# Altium schematic sheet Schematic.SchDoc
size A2
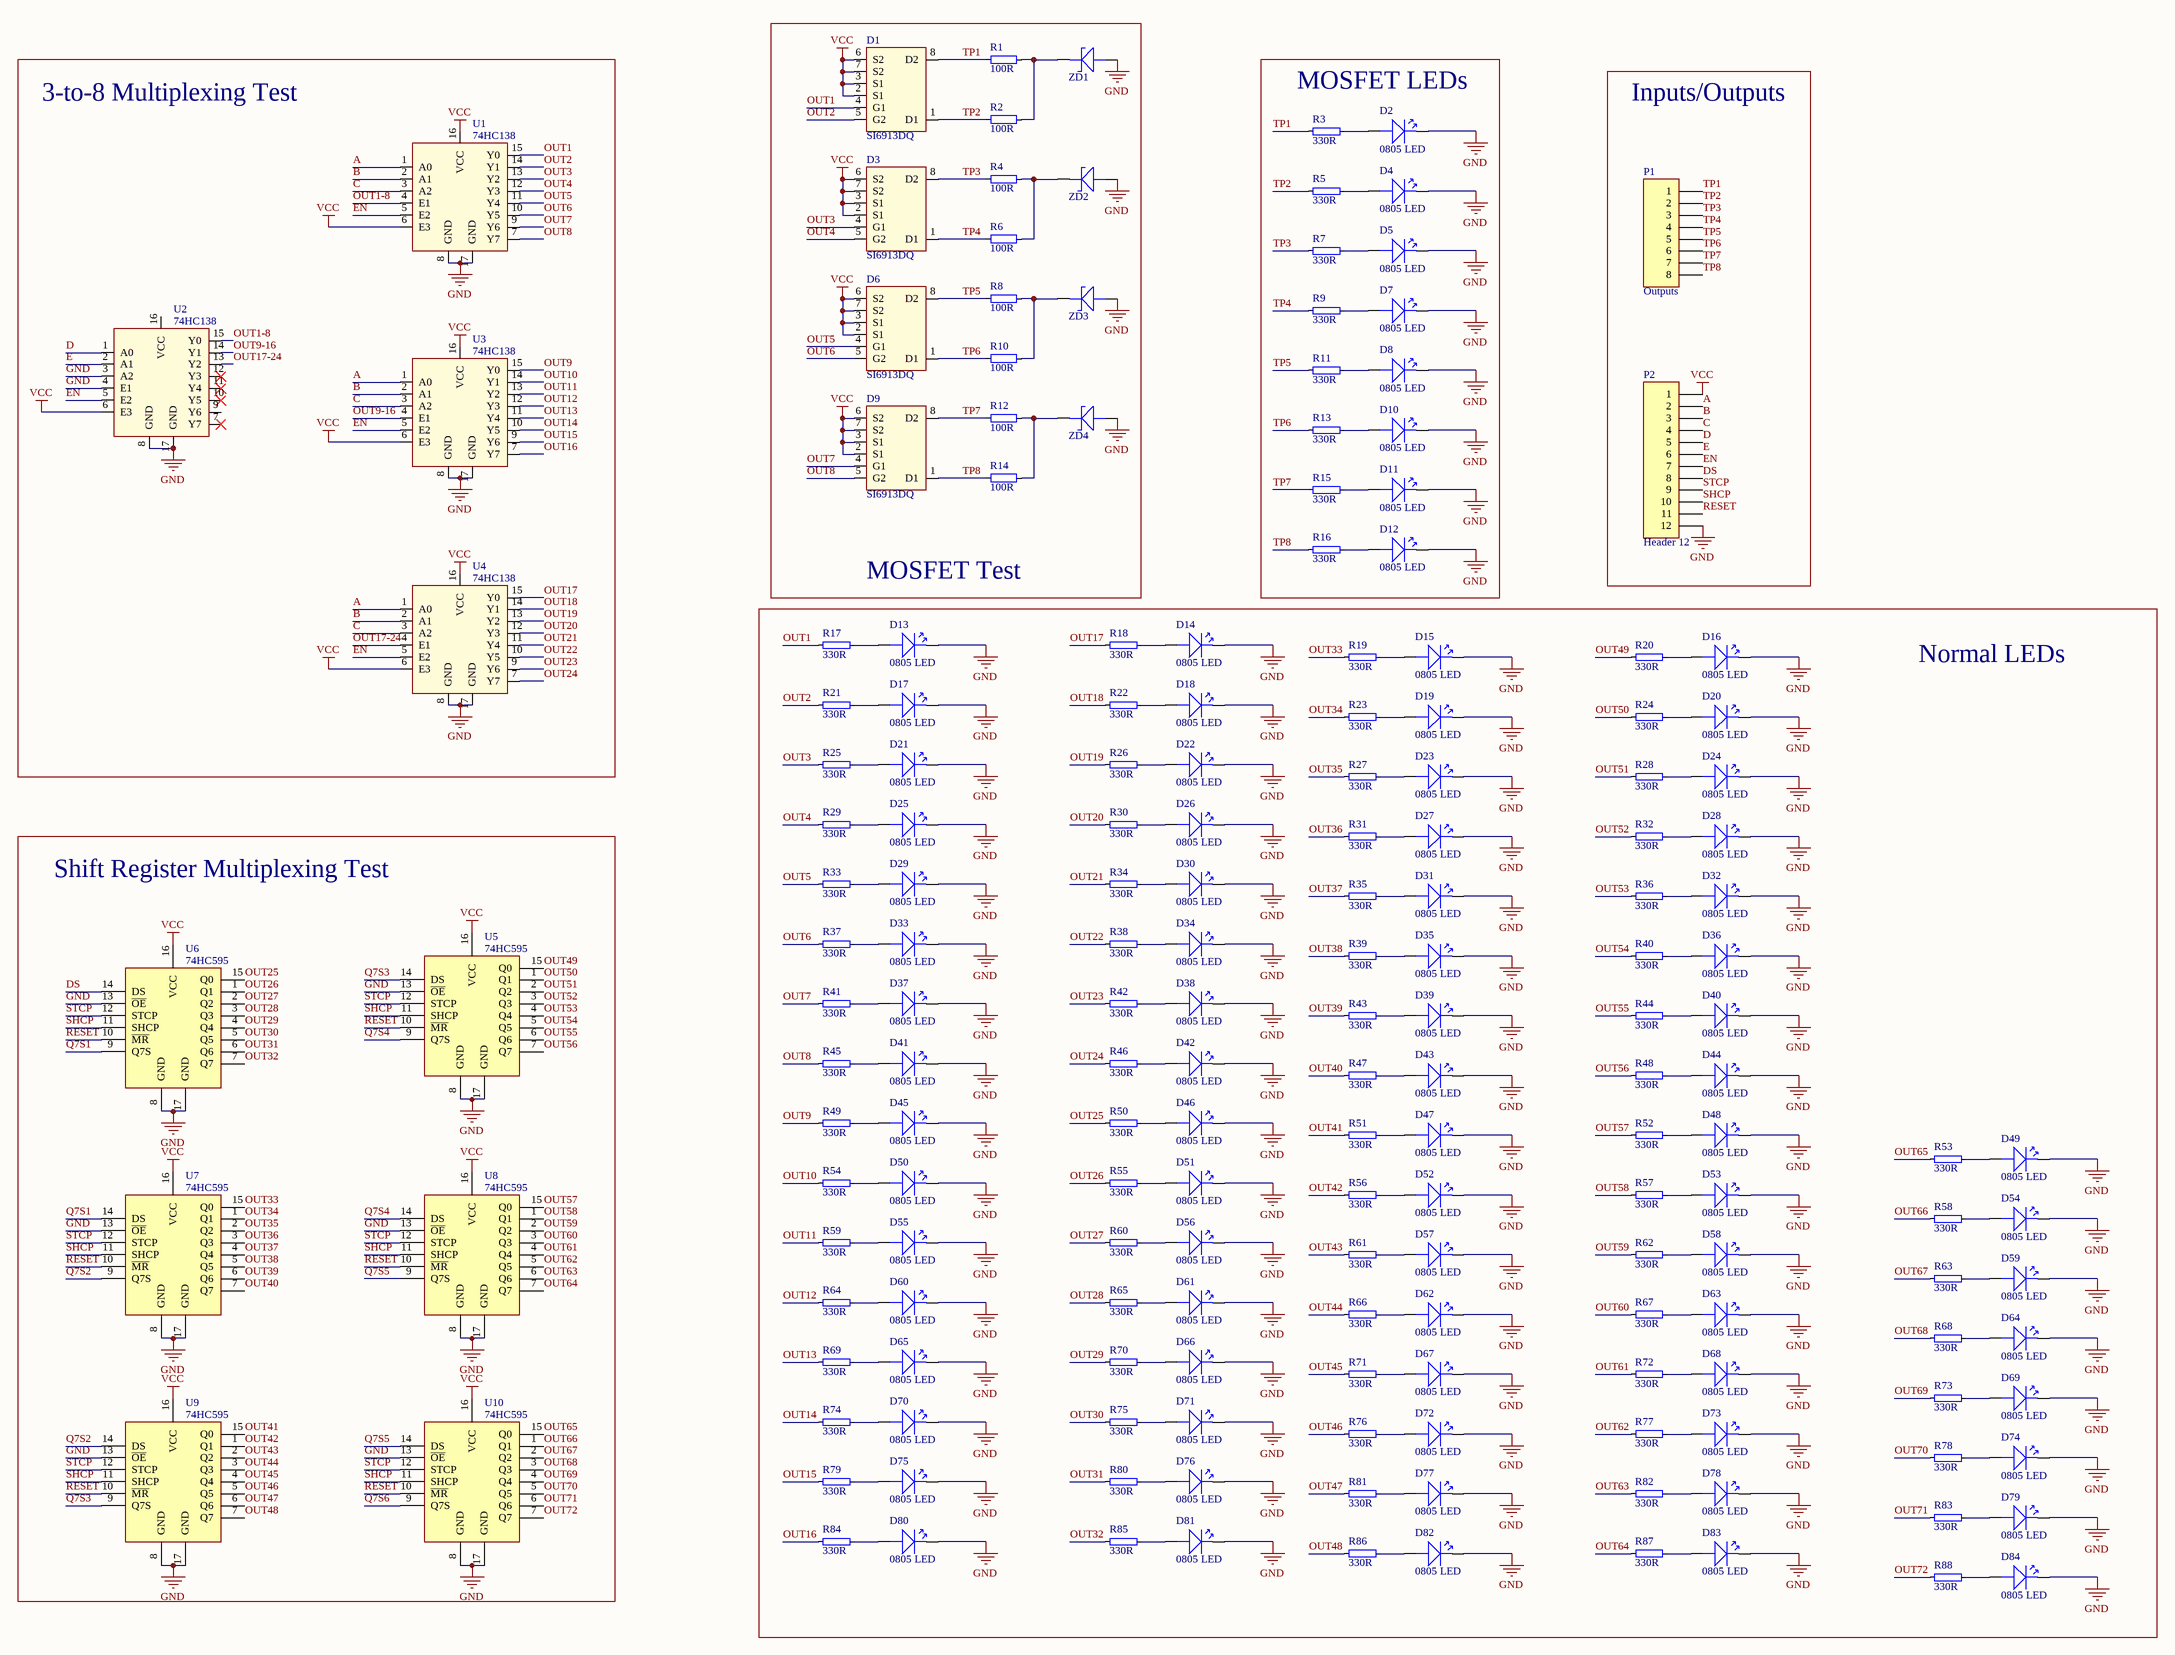
[diagram p0: Schematic.SchDoc]

## Parts
D1  SI6913DQ  [Dual Mosfet]
D2  0805 LED  [0805 LED]
D3  SI6913DQ  [Dual Mosfet]
D4  0805 LED  [0805 LED]
D5  0805 LED  [0805 LED]
D6  SI6913DQ  [Dual Mosfet]
D7  0805 LED  [0805 LED]
D8  0805 LED  [0805 LED]
D9  SI6913DQ  [Dual Mosfet]
D10  0805 LED  [0805 LED]
D11  0805 LED  [0805 LED]
D12  0805 LED  [0805 LED]
D13  0805 LED  [0805 LED]
D14  0805 LED  [0805 LED]
D15  0805 LED  [0805 LED]
D16  0805 LED  [0805 LED]
D17  0805 LED  [0805 LED]
D18  0805 LED  [0805 LED]
D19  0805 LED  [0805 LED]
D20  0805 LED  [0805 LED]
D21  0805 LED  [0805 LED]
D22  0805 LED  [0805 LED]
D23  0805 LED  [0805 LED]
D24  0805 LED  [0805 LED]
D25  0805 LED  [0805 LED]
D26  0805 LED  [0805 LED]
D27  0805 LED  [0805 LED]
D28  0805 LED  [0805 LED]
D29  0805 LED  [0805 LED]
D30  0805 LED  [0805 LED]
D31  0805 LED  [0805 LED]
D32  0805 LED  [0805 LED]
D33  0805 LED  [0805 LED]
D34  0805 LED  [0805 LED]
D35  0805 LED  [0805 LED]
D36  0805 LED  [0805 LED]
D37  0805 LED  [0805 LED]
D38  0805 LED  [0805 LED]
D39  0805 LED  [0805 LED]
D40  0805 LED  [0805 LED]
D41  0805 LED  [0805 LED]
D42  0805 LED  [0805 LED]
D43  0805 LED  [0805 LED]
D44  0805 LED  [0805 LED]
D45  0805 LED  [0805 LED]
D46  0805 LED  [0805 LED]
D47  0805 LED  [0805 LED]
D48  0805 LED  [0805 LED]
D49  0805 LED  [0805 LED]
D50  0805 LED  [0805 LED]
D51  0805 LED  [0805 LED]
D52  0805 LED  [0805 LED]
D53  0805 LED  [0805 LED]
D54  0805 LED  [0805 LED]
D55  0805 LED  [0805 LED]
D56  0805 LED  [0805 LED]
D57  0805 LED  [0805 LED]
D58  0805 LED  [0805 LED]
D59  0805 LED  [0805 LED]
D60  0805 LED  [0805 LED]
D61  0805 LED  [0805 LED]
D62  0805 LED  [0805 LED]
D63  0805 LED  [0805 LED]
D64  0805 LED  [0805 LED]
D65  0805 LED  [0805 LED]
D66  0805 LED  [0805 LED]
D67  0805 LED  [0805 LED]
D68  0805 LED  [0805 LED]
D69  0805 LED  [0805 LED]
D70  0805 LED  [0805 LED]
D71  0805 LED  [0805 LED]
D72  0805 LED  [0805 LED]
D73  0805 LED  [0805 LED]
D74  0805 LED  [0805 LED]
D75  0805 LED  [0805 LED]
D76  0805 LED  [0805 LED]
D77  0805 LED  [0805 LED]
D78  0805 LED  [0805 LED]
D79  0805 LED  [0805 LED]
D80  0805 LED  [0805 LED]
D81  0805 LED  [0805 LED]
D82  0805 LED  [0805 LED]
D83  0805 LED  [0805 LED]
D84  0805 LED  [0805 LED]
P1  Outputs  [HDR1X8]
P2  Header 12  [HDR1X12]
R1  100R  [0805 Resistor]
R2  100R  [0805 Resistor]
R3  330R  [0805 Resistor]
R4  100R  [0805 Resistor]
R5  330R  [0805 Resistor]
R6  100R  [0805 Resistor]
R7  330R  [0805 Resistor]
R8  100R  [0805 Resistor]
R9  330R  [0805 Resistor]
R10  100R  [0805 Resistor]
R11  330R  [0805 Resistor]
R12  100R  [0805 Resistor]
R13  330R  [0805 Resistor]
R14  100R  [0805 Resistor]
R15  330R  [0805 Resistor]
R16  330R  [0805 Resistor]
R17  330R  [0805 Resistor]
R18  330R  [0805 Resistor]
R19  330R  [0805 Resistor]
R20  330R  [0805 Resistor]
R21  330R  [0805 Resistor]
R22  330R  [0805 Resistor]
R23  330R  [0805 Resistor]
R24  330R  [0805 Resistor]
R25  330R  [0805 Resistor]
R26  330R  [0805 Resistor]
R27  330R  [0805 Resistor]
R28  330R  [0805 Resistor]
R29  330R  [0805 Resistor]
R30  330R  [0805 Resistor]
R31  330R  [0805 Resistor]
R32  330R  [0805 Resistor]
R33  330R  [0805 Resistor]
R34  330R  [0805 Resistor]
R35  330R  [0805 Resistor]
R36  330R  [0805 Resistor]
R37  330R  [0805 Resistor]
R38  330R  [0805 Resistor]
R39  330R  [0805 Resistor]
R40  330R  [0805 Resistor]
R41  330R  [0805 Resistor]
R42  330R  [0805 Resistor]
R43  330R  [0805 Resistor]
R44  330R  [0805 Resistor]
R45  330R  [0805 Resistor]
R46  330R  [0805 Resistor]
R47  330R  [0805 Resistor]
R48  330R  [0805 Resistor]
R49  330R  [0805 Resistor]
R50  330R  [0805 Resistor]
R51  330R  [0805 Resistor]
R52  330R  [0805 Resistor]
R53  330R  [0805 Resistor]
R54  330R  [0805 Resistor]
R55  330R  [0805 Resistor]
R56  330R  [0805 Resistor]
R57  330R  [0805 Resistor]
R58  330R  [0805 Resistor]
R59  330R  [0805 Resistor]
R60  330R  [0805 Resistor]
R61  330R  [0805 Resistor]
R62  330R  [0805 Resistor]
R63  330R  [0805 Resistor]
R64  330R  [0805 Resistor]
R65  330R  [0805 Resistor]
R66  330R  [0805 Resistor]
R67  330R  [0805 Resistor]
R68  330R  [0805 Resistor]
R69  330R  [0805 Resistor]
R70  330R  [0805 Resistor]
R71  330R  [0805 Resistor]
R72  330R  [0805 Resistor]
R73  330R  [0805 Resistor]
R74  330R  [0805 Resistor]
R75  330R  [0805 Resistor]
R76  330R  [0805 Resistor]
R77  330R  [0805 Resistor]
R78  330R  [0805 Resistor]
R79  330R  [0805 Resistor]
R80  330R  [0805 Resistor]
R81  330R  [0805 Resistor]
R82  330R  [0805 Resistor]
R83  330R  [0805 Resistor]
R84  330R  [0805 Resistor]
R85  330R  [0805 Resistor]
R86  330R  [0805 Resistor]
R87  330R  [0805 Resistor]
R88  330R  [0805 Resistor]
U1  74HC138  [74HC595]
U2  74HC138  [74HC595]
U3  74HC138  [74HC595]
U4  74HC138  [74HC595]
U5  74HC595  [74HC595]
U6  74HC595  [74HC595]
U7  74HC595  [74HC595]
U8  74HC595  [74HC595]
U9  74HC595  [74HC595]
U10  74HC595  [74HC595]
ZD1  3V  [Zener Diode]  (value not drawn)
ZD2  3V  [Zener Diode]  (value not drawn)
ZD3  3V  [Zener Diode]  (value not drawn)
ZD4  3V  [Zener Diode]  (value not drawn)

## Blocks framed on the sheet
3-to-8 Multiplexing Test: U1-U4
MOSFET Test: D1 D3 D6 D9 R1 R2 R4 R6 R8 R10 R12 R14 ZD1-ZD4
MOSFET LEDs: D2 D4 D5 D7 D8 D10-D12 R3 R5 R7 R9 R11 R13 R15 R16
Inputs/Outputs: P1 P2
Normal LEDs: D13-D84 R17-R88
Shift Register Multiplexing Test: U5-U10

## Nets
GND: D2.1 D4.1 D5.1 D7.1 D8.1 D10.1 D11.1 D12.1 D13.1 D14.1 D15.1 D16.1 D17.1 D18.1 D19.1 D20.1 D21.1 D22.1 D23.1 D24.1 D25.1 D26.1 D27.1 D28.1 D29.1 D30.1 D31.1 D32.1 D33.1 D34.1 D35.1 D36.1 D37.1 D38.1 D39.1 D40.1 D41.1 D42.1 D43.1 D44.1 D45.1 D46.1 D47.1 D48.1 D49.1 D50.1 D51.1 D52.1 D53.1 D54.1 D55.1 D56.1 D57.1 D58.1 D59.1 D60.1 D61.1 D62.1 D63.1 D64.1 D65.1 D66.1 D67.1 D68.1 D69.1 D70.1 D71.1 D72.1 D73.1 D74.1 D75.1 D76.1 D77.1 D78.1 D79.1 D80.1 D81.1 D82.1 D83.1 D84.1 P2.12 U1.8(GND) U1.17(GND) U2.3(A2) U2.4(E1) U2.8(GND) U2.17(GND) U3.8(GND) U3.17(GND) U4.8(GND) U4.17(GND) U5.8(GND) U5.13(~{OE}) U5.17(GND) U6.8(GND) U6.13(~{OE}) U6.17(GND) U7.8(GND) U7.13(~{OE}) U7.17(GND) U8.8(GND) U8.13(~{OE}) U8.17(GND) U9.8(GND) U9.13(~{OE}) U9.17(GND) U10.8(GND) U10.13(~{OE}) U10.17(GND) ZD1.2 ZD2.2 ZD3.2 ZD4.2
VCC: D1.2(S1) D1.3(S1) D1.6(S2) D1.7(S2) D3.2(S1) D3.3(S1) D3.6(S2) D3.7(S2) D6.2(S1) D6.3(S1) D6.6(S2) D6.7(S2) D9.2(S1) D9.3(S1) D9.6(S2) D9.7(S2) P2.1 U1.6(E3) U1.16(VCC) U2.6(E3) U3.6(E3) U3.16(VCC) U4.6(E3) U4.16(VCC) U5.16(VCC) U6.16(VCC) U7.16(VCC) U8.16(VCC) U9.16(VCC) U10.16(VCC)
A: P2.2 U1.1(A0) U3.1(A0) U4.1(A0)
B: P2.3 U1.2(A1) U3.2(A1) U4.2(A1)
C: P2.4 U1.3(A2) U3.3(A2) U4.3(A2)
D: P2.5 U2.1(A0)
DS: P2.8 U6.14(DS)
E: P2.6 U2.2(A1)
EN: P2.7 U1.5(E2) U2.5(E2) U3.5(E2) U4.5(E2)
OUT1: D1.4(G1) R17.2 U1.15(Y0)
OUT1-8: U1.4(E1) U2.15(Y0)
OUT2: D1.5(G2) R21.2 U1.14(Y1)
OUT3: D3.4(G1) R25.2 U1.13(Y2)
OUT4: D3.5(G2) R29.2 U1.12(Y3)
OUT5: D6.4(G1) R33.2 U1.11(Y4)
OUT6: D6.5(G2) R37.2 U1.10(Y5)
OUT7: D9.4(G1) R41.2 U1.9(Y6)
OUT8: D9.5(G2) R45.2 U1.7(Y7)
OUT9: R49.2 U3.15(Y0)
OUT9-16: U2.14(Y1) U3.4(E1)
OUT10: R54.2 U3.14(Y1)
OUT11: R59.2 U3.13(Y2)
OUT12: R64.2 U3.12(Y3)
OUT13: R69.2 U3.11(Y4)
OUT14: R74.2 U3.10(Y5)
OUT15: R79.2 U3.9(Y6)
OUT16: R84.2 U3.7(Y7)
OUT17: R18.2 U4.15(Y0)
OUT17-24: U2.13(Y2) U4.4(E1)
OUT18: R22.2 U4.14(Y1)
OUT19: R26.2 U4.13(Y2)
OUT20: R30.2 U4.12(Y3)
OUT21: R34.2 U4.11(Y4)
OUT22: R38.2 U4.10(Y5)
OUT23: R42.2 U4.9(Y6)
OUT24: R46.2 U4.7(Y7)
OUT25: R50.2 U6.15(Q0)
OUT26: R55.2 U6.1(Q1)
OUT27: R60.2 U6.2(Q2)
OUT28: R65.2 U6.3(Q3)
OUT29: R70.2 U6.4(Q4)
OUT30: R75.2 U6.5(Q5)
OUT31: R80.2 U6.6(Q6)
OUT32: R85.2 U6.7(Q7)
OUT33: R19.2 U7.15(Q0)
OUT34: R23.2 U7.1(Q1)
OUT35: R27.2 U7.2(Q2)
OUT36: R31.2 U7.3(Q3)
OUT37: R35.2 U7.4(Q4)
OUT38: R39.2 U7.5(Q5)
OUT39: R43.2 U7.6(Q6)
OUT40: R47.2 U7.7(Q7)
OUT41: R51.2 U9.15(Q0)
OUT42: R56.2 U9.1(Q1)
OUT43: R61.2 U9.2(Q2)
OUT44: R66.2 U9.3(Q3)
OUT45: R71.2 U9.4(Q4)
OUT46: R76.2 U9.5(Q5)
OUT47: R81.2 U9.6(Q6)
OUT48: R86.2 U9.7(Q7)
OUT49: R20.2 U5.15(Q0)
OUT50: R24.2 U5.1(Q1)
OUT51: R28.2 U5.2(Q2)
OUT52: R32.2 U5.3(Q3)
OUT53: R36.2 U5.4(Q4)
OUT54: R40.2 U5.5(Q5)
OUT55: R44.2 U5.6(Q6)
OUT56: R48.2 U5.7(Q7)
OUT57: R52.2 U8.15(Q0)
OUT58: R57.2 U8.1(Q1)
OUT59: R62.2 U8.2(Q2)
OUT60: R67.2 U8.3(Q3)
OUT61: R72.2 U8.4(Q4)
OUT62: R77.2 U8.5(Q5)
OUT63: R82.2 U8.6(Q6)
OUT64: R87.2 U8.7(Q7)
OUT65: R53.2 U10.15(Q0)
OUT66: R58.2 U10.1(Q1)
OUT67: R63.2 U10.2(Q2)
OUT68: R68.2 U10.3(Q3)
OUT69: R73.2 U10.4(Q4)
OUT70: R78.2 U10.5(Q5)
OUT71: R83.2 U10.6(Q6)
OUT72: R88.2 U10.7(Q7)
Q7S1: U6.9(Q7S) U7.14(DS)
Q7S2: U7.9(Q7S) U9.14(DS)
Q7S3: U5.14(DS) U9.9(Q7S)
Q7S4: U5.9(Q7S) U8.14(DS)
Q7S5: U8.9(Q7S) U10.14(DS)
Q7S6: U10.9(Q7S)
RESET: P2.11 U5.10(~{MR}) U6.10(~{MR}) U7.10(~{MR}) U8.10(~{MR}) U9.10(~{MR}) U10.10(~{MR})
SHCP: P2.10 U5.11(SHCP) U6.11(SHCP) U7.11(SHCP) U8.11(SHCP) U9.11(SHCP) U10.11(SHCP)
STCP: P2.9 U5.12(STCP) U6.12(STCP) U7.12(STCP) U8.12(STCP) U9.12(STCP) U10.12(STCP)
TP1: D1.8(D2) P1.1 R1.1 R3.2
TP2: D1.1(D1) P1.2 R2.1 R5.2
TP3: D3.8(D2) P1.3 R4.1 R7.2
TP4: D3.1(D1) P1.4 R6.1 R9.2
TP5: D6.8(D2) P1.5 R8.1 R11.2
TP6: D6.1(D1) P1.6 R10.1 R13.2
TP7: D9.8(D2) P1.7 R12.1 R15.2
TP8: D9.1(D1) P1.8 R14.1 R16.2
NetD2_2: D2.2 R3.1
NetD4_2: D4.2 R5.1
NetD5_2: D5.2 R7.1
NetD7_2: D7.2 R9.1
NetD8_2: D8.2 R11.1
NetD10_2: D10.2 R13.1
NetD11_2: D11.2 R15.1
NetD12_2: D12.2 R16.1
NetD13_2: D13.2 R17.1
NetD14_2: D14.2 R18.1
NetD15_2: D15.2 R19.1
NetD16_2: D16.2 R20.1
NetD17_2: D17.2 R21.1
NetD18_2: D18.2 R22.1
NetD19_2: D19.2 R23.1
NetD20_2: D20.2 R24.1
NetD21_2: D21.2 R25.1
NetD22_2: D22.2 R26.1
NetD23_2: D23.2 R27.1
NetD24_2: D24.2 R28.1
NetD25_2: D25.2 R29.1
NetD26_2: D26.2 R30.1
NetD27_2: D27.2 R31.1
NetD28_2: D28.2 R32.1
NetD29_2: D29.2 R33.1
NetD30_2: D30.2 R34.1
NetD31_2: D31.2 R35.1
NetD32_2: D32.2 R36.1
NetD33_2: D33.2 R37.1
NetD34_2: D34.2 R38.1
NetD35_2: D35.2 R39.1
NetD36_2: D36.2 R40.1
NetD37_2: D37.2 R41.1
NetD38_2: D38.2 R42.1
NetD39_2: D39.2 R43.1
NetD40_2: D40.2 R44.1
NetD41_2: D41.2 R45.1
NetD42_2: D42.2 R46.1
NetD43_2: D43.2 R47.1
NetD44_2: D44.2 R48.1
NetD45_2: D45.2 R49.1
NetD46_2: D46.2 R50.1
NetD47_2: D47.2 R51.1
NetD48_2: D48.2 R52.1
NetD49_2: D49.2 R53.1
NetD50_2: D50.2 R54.1
NetD51_2: D51.2 R55.1
NetD52_2: D52.2 R56.1
NetD53_2: D53.2 R57.1
NetD54_2: D54.2 R58.1
NetD55_2: D55.2 R59.1
NetD56_2: D56.2 R60.1
NetD57_2: D57.2 R61.1
NetD58_2: D58.2 R62.1
NetD59_2: D59.2 R63.1
NetD60_2: D60.2 R64.1
NetD61_2: D61.2 R65.1
NetD62_2: D62.2 R66.1
NetD63_2: D63.2 R67.1
NetD64_2: D64.2 R68.1
NetD65_2: D65.2 R69.1
NetD66_2: D66.2 R70.1
NetD67_2: D67.2 R71.1
NetD68_2: D68.2 R72.1
NetD69_2: D69.2 R73.1
NetD70_2: D70.2 R74.1
NetD71_2: D71.2 R75.1
NetD72_2: D72.2 R76.1
NetD73_2: D73.2 R77.1
NetD74_2: D74.2 R78.1
NetD75_2: D75.2 R79.1
NetD76_2: D76.2 R80.1
NetD77_2: D77.2 R81.1
NetD78_2: D78.2 R82.1
NetD79_2: D79.2 R83.1
NetD80_2: D80.2 R84.1
NetD81_2: D81.2 R85.1
NetD82_2: D82.2 R86.1
NetD83_2: D83.2 R87.1
NetD84_2: D84.2 R88.1
NetR1_2: R1.2 R2.2 ZD1.1
NetR4_2: R4.2 R6.2 ZD2.1
NetR8_2: R8.2 R10.2 ZD3.1
NetR12_2: R12.2 R14.2 ZD4.1

Not connected (* = marked no-connect by the designer): U2 7(Y7)* 9(Y6) 10(Y5)* 11(Y4)* 12(Y3)* 16(VCC)

## Library data of the parts
P1 = Header 8: Header, 8-Pin; LatestRevisionDate: 17-Jul-2002; LatestRevisionNote: Re-released for DXP Platform.; Publisher: Altium Limited
P2 = Header 12: Header, 12-Pin; LatestRevisionDate: 17-Jul-2002; LatestRevisionNote: Re-released for DXP Platform.; Publisher: Altium Limited
R1-R88 = 0805 Resistor
ZD1-ZD4 = BZV55-C3V0